# EAGLE design IICLCDKeyPad (EAGLE 6.1)

## Sheet 1 of 2
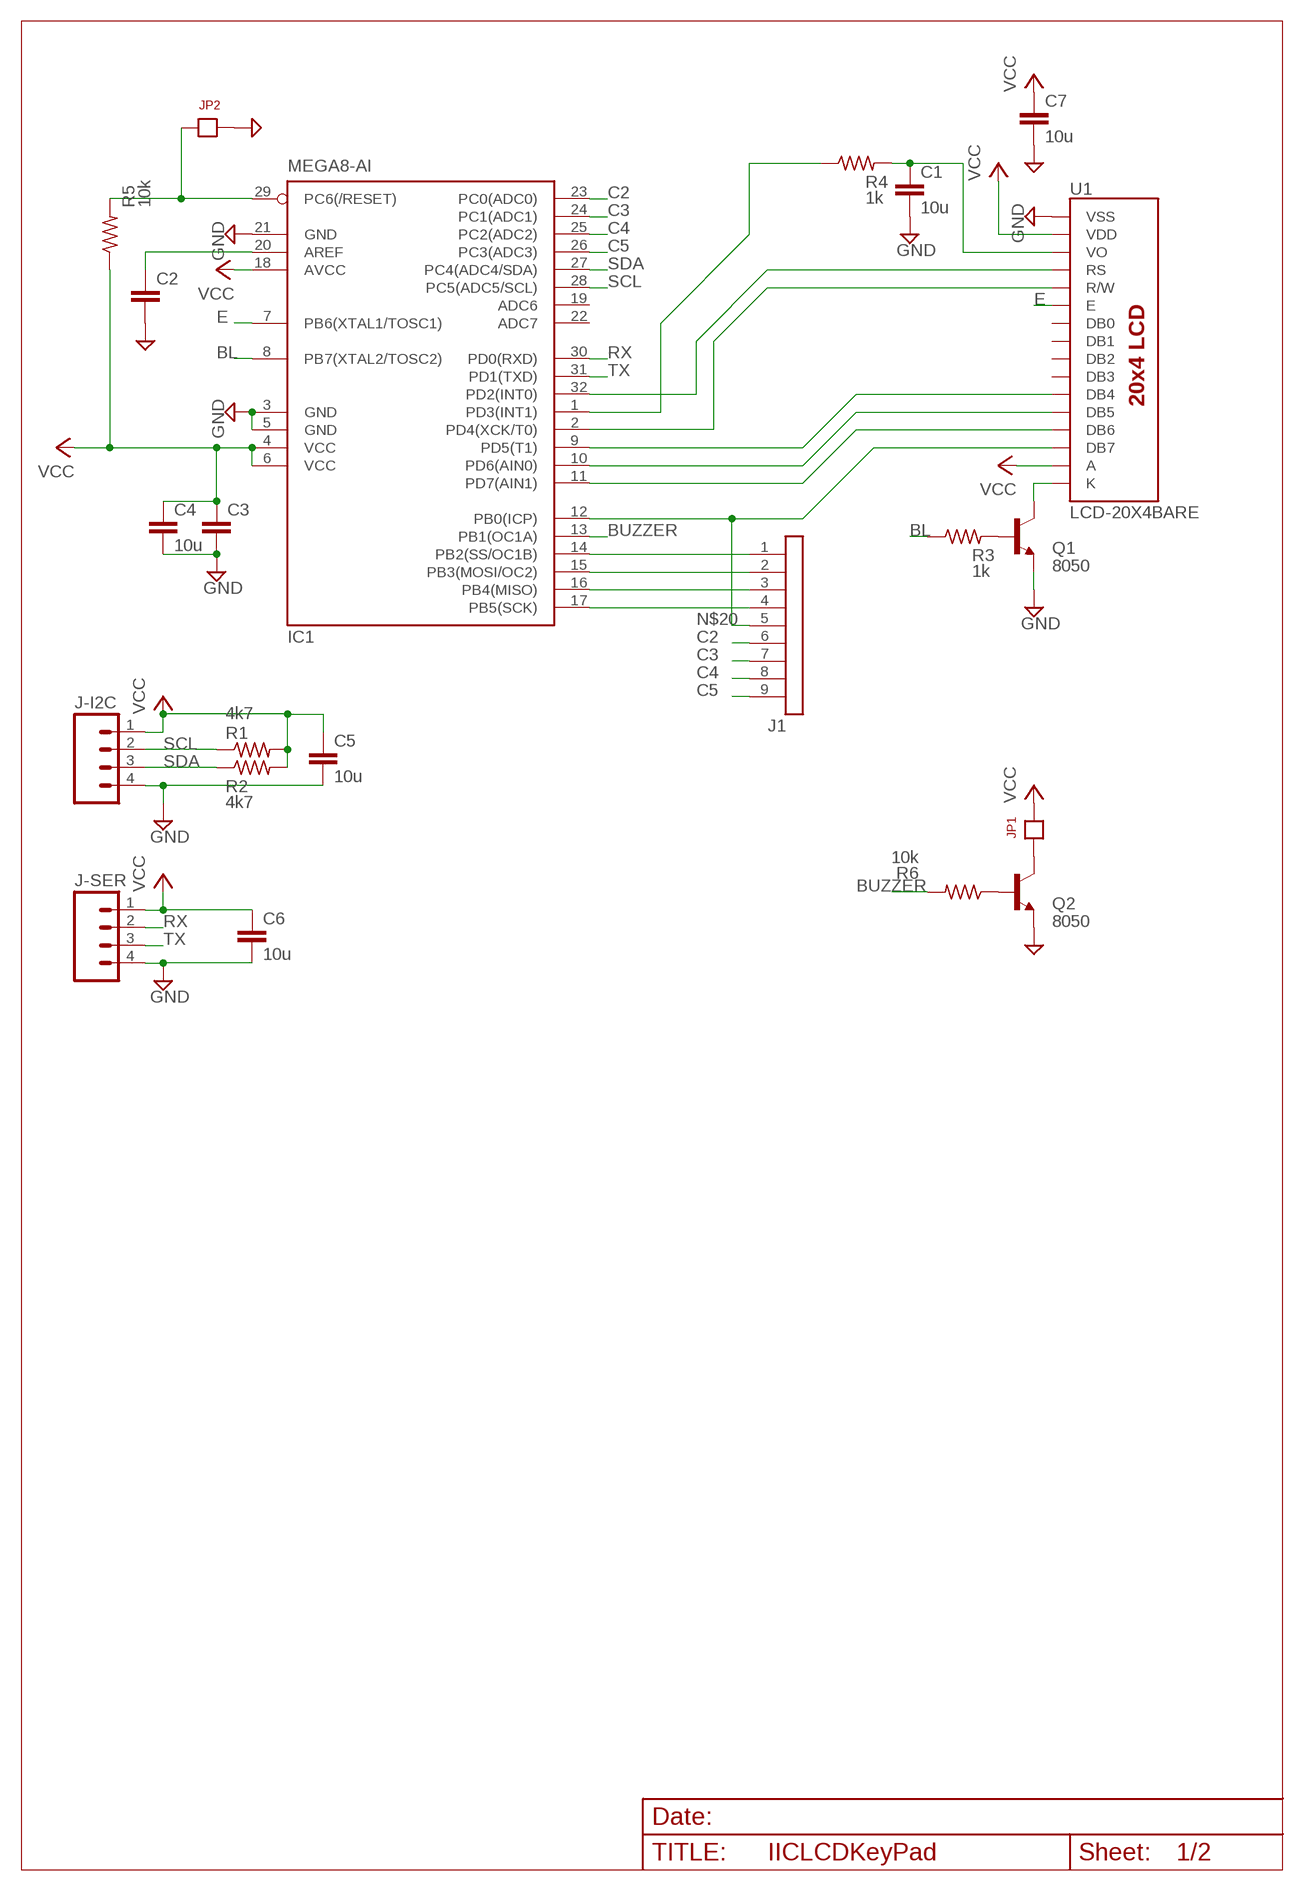
[diagram p0: schematic, sheet 1]

### Parts
C1  10u  CAP0805  [0805]
C2  CAP0603-CAP  [0603-CAP]
C3  CAP0603-CAP  [0603-CAP]
C4  10u  CAP0805  [0805]
C5  10u  CAP0805  [0805]
C6  10u  CAP0805  [0805]
C7  10u  CAP0805  [0805]
IC1  MEGA8-AI  [TQFP32-08]
J1  SIL-9  [SIL-9]
J-I2C  MO4POL  [MOLEX-4]
J-SER  MO4POL  [MOLEX-4]
JP1  JP1  [JP1]
JP2  JP1  [JP1]
Q1  8050  BC849SMD  [SOT23-BEC]
Q2  8050  BC849SMD  [SOT23-BEC]
R1  4k7  R-US_R0603  [R0603]
R2  4k7  R-US_R0603  [R0603]
R3  1k  R-US_R0603  [R0603]
R4  1k  R-US_R0603  [R0603]
R5  10k  R-US_R0603  [R0603]
R6  10k  R-US_R0603  [R0603]
U1  LCD-20X4BARE  [LCD-16X2_BARE]

### Nets
BL: IC1.8(PB7(XTAL2/TOSC2)) R3.1
BUZZER: IC1.13(PB1(OC1A)) R6.2
C2: IC1.23(PC0(ADC0)) J1.6
C3: IC1.24(PC1(ADC1)) J1.7
C4: IC1.25(PC2(ADC2)) J1.8
C5: IC1.26(PC3(ADC3)) J1.9
D6: IC1.11(PD7(AIN1)) U1.13(DB6)
E: IC1.7(PB6(XTAL1/TOSC1)) U1.6(E)
GND: C1.2 C2.2 C3.2 C4.2 C5.2 C6.2 C7.2 IC1.3(GND) IC1.5(GND) IC1.21(GND) J-I2C.4 J-SER.4 JP2.2 Q1.E Q2.E U1.1(VSS)
N$1: IC1.14(PB2(SS/OC1B)) J1.1
N$2: Q1.C U1.16(K)
N$3: Q1.B R3.2
N$4: C1.1 R4.2 U1.3(VO)
N$5: IC1.9(PD5(T1)) U1.11(DB4)
N$6: C2.1 IC1.20(AREF)
N$7: IC1.10(PD6(AIN0)) U1.12(DB5)
N$8: IC1.1(PD3(INT1)) R4.1
N$9: IC1.32(PD2(INT0)) U1.4(RS)
N$11: JP1.1 Q2.C
N$12: Q2.B R6.1
N$13: IC1.2(PD4(XCK/T0)) U1.5(R/W)
N$14: IC1.15(PB3(MOSI/OC2)) J1.2
N$16: IC1.29(PC6(/RESET)) JP2.1 R5.2
N$17: IC1.16(PB4(MISO)) J1.3
N$18: IC1.17(PB5(SCK)) J1.4
N$20: IC1.12(PB0(ICP)) J1.5 U1.14(DB7)
RX: IC1.30(PD0(RXD)) J-SER.2
SCL: IC1.28(PC5(ADC5/SCL)) J-I2C.2 R1.1
SDA: IC1.27(PC4(ADC4/SDA)) J-I2C.3 R2.1
TX: IC1.31(PD1(TXD)) J-SER.3
VCC: C3.1 C4.1 C5.1 C6.1 C7.1 IC1.4(VCC) IC1.6(VCC) IC1.18(AVCC) J-I2C.1 J-SER.1 JP1.2 R1.2 R2.2 R5.1 U1.2(VDD) U1.15(A)
Unconnected: IC1.19(ADC6) IC1.22(ADC7) U1.7(DB0) U1.8(DB1) U1.9(DB2) U1.10(DB3)

## Sheet 2 of 2

## Library data of the parts
C1-C7 = SparkFun-Passives:CAP: Capacitor Standard 0603 ceramic capacitor, and 0.1" leaded capacitor.
IC1 = atmel:MEGA8: MICROCONTROLLER 8 Kbytes FLASH, 1 kbytes SRAM, 512 bytes EEPROM, USART, 6-channel 10 bit ADC, 2-channel 8 bit ADC Pin compatible with Atmega48, ATMega88, ATMega168 Source: avr.lbr; MPN: ATMEGA8-16AU; OC_FARNELL: 9171371; OC_NEWARK: 73M8863
J1 = Andrew Connectors:SIL-9
J-I2C J-SER = Andrew Connectors:MO4POL
JP1 JP2 = Andrew Connectors:JP1
Q1 Q2 = transistor-npn:BC849*: NPN Transistor
R1-R6 = rcl:R-US_: RESISTOR, American symbol
U1 = Andrew Misc:LCD-20X4: Standard text-only 16x2 parallel input LCD

## Board
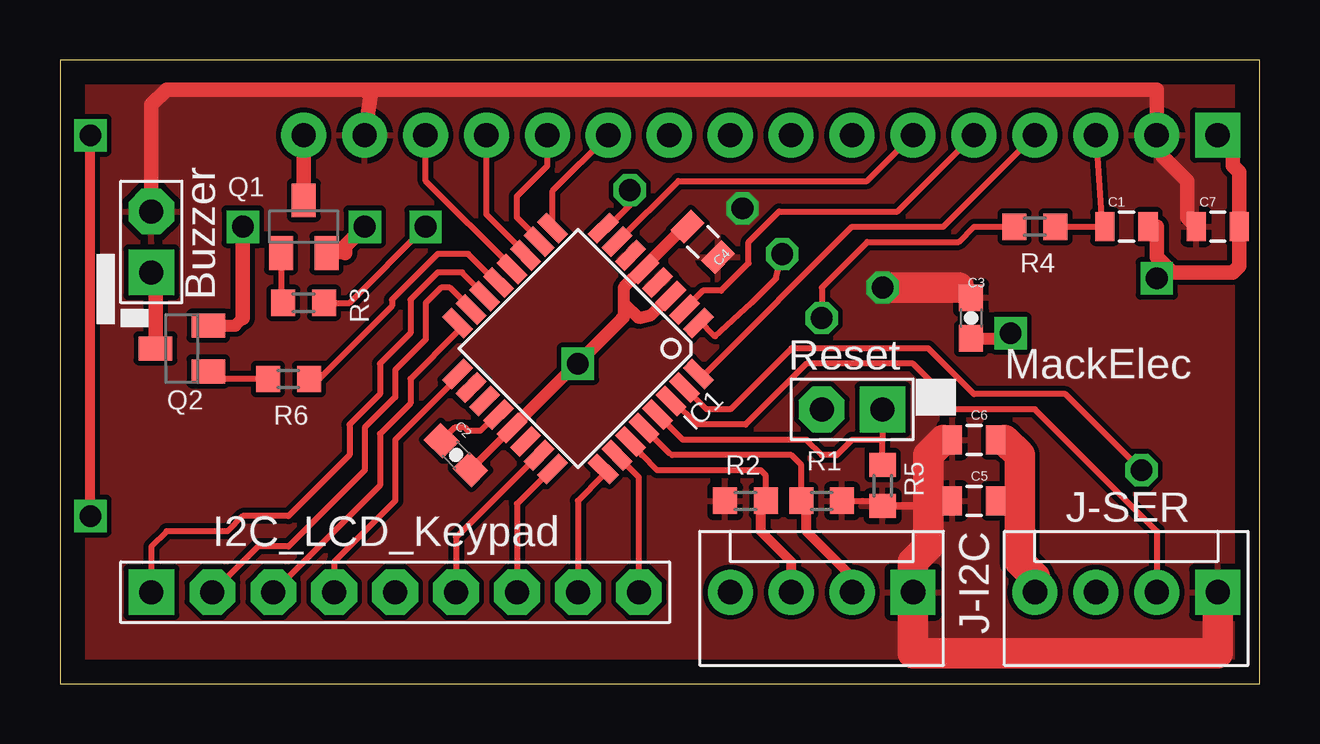
[diagram p1: board, top side]
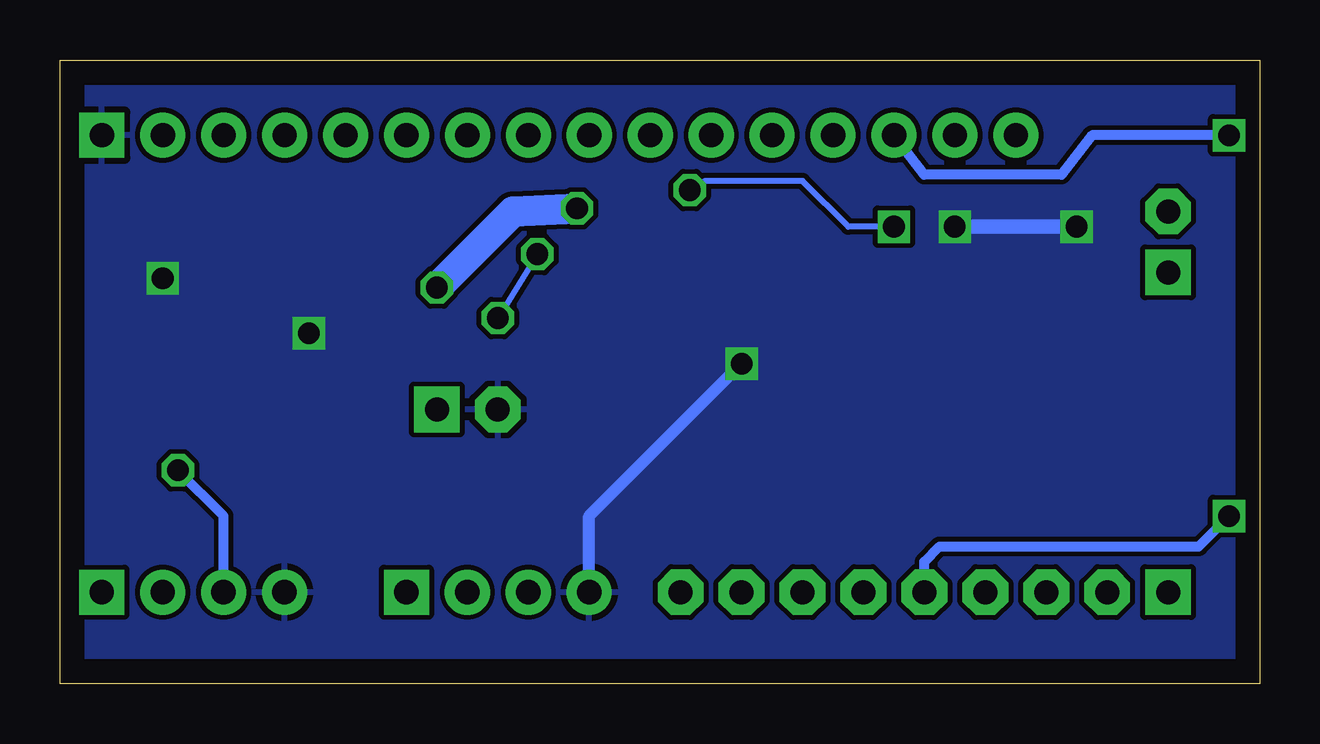
[diagram p2: board, bottom side, seen from below]

Size 50 x 26 mm. Coordinates in mm from the lower left corner, seen from the top.
Outline: 0,0 50,0 50,26 0,26 0,0
Copper layers (1*16): Top 0.035mm / dielectric 1.5mm / Bottom 0.035mm
Design rules: minimum track width 10mil, minimum drill 24mil, track to track 8mil, track to pad 8mil, pad to pad 8mil, via to via 8mil, smd to smd 8mil, copper to edge 40mil, drill to drill 8mil, minimum pad ring 10mil, minimum via ring 8mil, stop-mask expansion 4mil, vias tented up to drill 0mil, thermal gap 10mil

### Footprints (pad centres in the part's own frame; a part is rotated, then mirrored left to right if it is on the bottom)
0805 = smd 0.8 x 1.2: 1 -0.9,0; 2 0.9,0
0603-CAP = smd 1.1 x 1: 1 -0.85,0; 2 0.85,0
TQFP32-08 = smd 1.27 x 0.559: 1 -4.293,2.8; 2 -4.293,2; 3 -4.293,1.2; 4 -4.293,0.4; 5 -4.293,-0.4; 6 -4.293,-1.2; 7 -4.293,-2; 8 -4.293,-2.8; 17 4.293,-2.8; 18 4.293,-2; 19 4.293,-1.2; 20 4.293,-0.4; 21 4.293,0.4; 22 4.293,1.2; 23 4.293,2; 24 4.293,2.8 | smd 0.559 x 1.27: 9 -2.8,-4.293; 10 -2,-4.293; 11 -1.2,-4.293; 12 -0.4,-4.293; 13 0.4,-4.293; 14 1.2,-4.293; 15 2,-4.293; 16 2.8,-4.293; 25 2.8,4.293; 26 2,4.293; 27 1.2,4.293; 28 0.4,4.293; 29 -0.4,4.293; 30 -1.2,4.293; 31 -2,4.293; 32 -2.8,4.293
SIL-9 = drill 1 pad 1.905 square: 1 -11.43,0 | drill 1 pad 1.905 octagon: 2 -8.89,0; 3 -6.35,0; 4 -3.81,0; 5 -1.27,0; 6 1.27,0; 7 3.81,0; 8 6.35,0; 9 8.89,0
MOLEX-4 = drill 1.016 pad 1.88 square: 1 -3.81,0 | drill 1.016 pad 1.88: 2 -1.27,0; 3 1.27,0; 4 3.81,0
JP1 = drill 1 pad 1.905 square: 1 -1.27,0 | drill 1 pad 1.905 octagon: 2 1.27,0
SOT23-BEC = smd 1 x 1.4: B -0.95,-1.1; C 0,1.1; E 0.95,-1.1
R0603 = smd 1 x 1.1: 1 -0.85,0; 2 0.85,0
LCD-16X2_BARE = drill 1.016 pad 1.88 square: 1 0.004,0.006 | drill 1.016 pad 1.88: 2 2.544,0.006; 3 5.084,0.006; 4 7.624,0.006; 5 10.164,0.006; 6 12.704,0.006; 7 15.244,0.006; 8 17.784,0.006; 9 20.324,0.006; 10 22.864,0.006; 11 25.404,0.006; 12 27.944,0.006; 13 30.484,0.006; 14 33.024,0.006; 15 35.564,0.006; 16 38.104,0.006

### Placement (x,y rotation side)
C1  44.45,19.05 0 top
C2  16.51,9.53 315 top
C3  37.97,15.24 270 top
C4  26.8,18.41 135 top
C5  38.1,7.62 0 top
C6  38.1,10.16 0 top
C7  48.26,19.05 0 top
IC1  21.59,13.97 225 top
J1  15.24,3.81 0 top
J-I2C  31.75,3.81 180 top
J-SER  44.45,3.81 180 top
JP1  3.81,18.41 90 top
JP2  33.02,11.43 180 top
Q1  10.16,19.05 0 top
Q2  5.08,13.97 90 top
R1  31.75,7.62 0 top
R2  28.57,7.62 180 top
R3  10.16,15.88 180 top
R4  40.64,19.05 0 top
R5  34.29,8.26 90 top
R6  9.53,12.7 0 top
U1  48.26,22.86 0 bottom

### Tracks (layer width: path | path; a pad name or v marks a point on that pad's centre or on a via)
BL  (via drill 0.9)
  Top 0.254: R3.1 12.06,15.88 v15.24,19.05 | v23.75,20.57 24.13,20.32 22.8,18.98 IC1.8
  Bottom 0.254: v15.24,19.05 17.14,19.05 19.05,20.95 23.11,20.95 v23.75,20.57
BUZZER
  Top 0.254: IC1.13 18.2,16.72 17.02,17.91 15.75,17.91 13.84,16 13.84,15.75 10.79,12.7 R6.2
C2
  Top 0.254: IC1.23 19.71,9.3 16.51,6.1 J1.6
C3
  Top 0.254: IC1.24 20.54,8.98 19.05,7.49 J1.7
C4
  Top 0.254: IC1.25 22.64,8.68 21.59,7.62 J1.8
C5
  Top 0.254: J1.9 24.13,8.6 IC1.26
D6
  Top 0.254: IC1.11 19.4,17.93 17.78,19.56 U1.13
E
  Top 0.254: U1.6 33.65,20.95 25.78,20.95 23.25,18.42 IC1.7
GND  (via drill 0.9)
  Top 0.254: C4.2 26.16,19.18
  Top 0.305: 39.37,10.16 C6.2 | C5.2 40.01,7.62 | C2.2 IC1.21
  Top 0.508: 23.5,15.88 23.5,16.51 24.27,17.29 IC1.5 24.34,17.36 26.16,19.18 | 23.5,15.88 24.13,15.24 24.64,15.37 25.35,16.08 IC1.3 | 23.5,15.88 23.5,15.24 | 23.5,15.24 23.43,15.24 IC1.21 | v21.59,13.34 23.5,15.24 | Q2.E 7.3,14.92 7.62,15.24 | Q1.E 11.89,17.95 | C3.2 39.41,14.39 v39.62,14.61
  Top 0.61: 11.89,17.95 11.89,18.25 v12.7,19.05 | v7.62,19.05 7.62,15.24 | U1.1 48.9,22.73 48.9,21.59 49.16,21.32 C7.2 49.16,17.41 48.9,17.14 46.35,17.14 45.72,17.78 45.72,19.05 C1.2
  Top 1.27: J-SER.4 40.64,4.45 40.01,5.08 40.01,7.62 40.01,9.53 39.37,10.16
  Bottom 0.508: J-I2C.4 27.94,6.99 v21.59,13.34
  Bottom 0.61: v12.7,19.05 v7.62,19.05
  other vias: 45.72,16.89
  pour Bottom: 0.64,25.4 49.53,25.4 49.53,0.64 0.64,0.64
N$1
  Top 0.254: IC1.14 17.75,16.16 16.76,17.14 15.75,17.14 14.61,16 14.61,14.61 13.34,13.34 13.34,12.06 12.06,10.79 12.06,9.53 9.53,6.99 7.62,6.99 6.99,6.35 4.45,6.35 3.81,5.71 J1.1
N$2
  Top 0.61: Q1.C U1.16
N$3
  Top 0.254: Q1.B 9.21,16.19 9.53,15.88 R3.2
N$4
  Top 0.254: R4.2 C1.1 43.43,19.17 U1.3
N$5
  Top 0.254: IC1.9 20.54,20.55 U1.11
N$6
  Top 0.254: IC1.20 18.2,11.22 17.53,10.54 17.02,10.54 16.89,10.67 16.45,10.67 C2.1
N$7
  Top 0.254: IC1.10 19.97,18.51 19.05,19.43 19.05,20.32 20.32,21.59 U1.12
N$8  (via drill 0.9)
  Top 0.254: IC1.1 26.61,15.18 27.3,14.48 28.83,15.88 29.84,16.89 v30.1,17.91 | R4.1 38.1,19.05 37.47,18.41 33.66,18.41 31.75,16.51 v31.75,15.24
  Bottom 0.254: v30.1,17.91 v31.75,15.24
N$9
  Top 0.254: IC1.32 26.89,12.91 33.02,19.05 36.82,19.05 U1.4
N$11
  Top 0.61: Q2.C 3.98,16.98 JP1.1
N$12
  Top 0.254: R6.1 6.5,12.7 Q2.B
N$13
  Top 0.254: IC1.2 26.29,15.88 26.8,16.38 27.56,16.38 28.7,17.53 28.7,18.41 29.97,19.68 34.91,19.68 U1.5
N$14
  Top 0.254: IC1.15 16.89,15.88 16.26,16.51 15.88,16.51 15.24,15.88 15.24,14.35 13.97,13.08 13.97,11.94 12.7,10.67 12.7,8.89 9.53,5.71 8.26,5.71 J1.2
N$16
  Top 0.254: R5.2 34.29,10.16 | JP2.1 34.29,10.16 | 34.29,10.16 33.02,10.16 32.38,9.53 31.75,9.53 31.11,10.16 25.97,10.16 IC1.29
N$17
  Top 0.254: IC1.16 16.57,14.67 14.61,12.7 14.61,11.68 13.34,10.41 13.34,8.26 J1.3
N$18
  Top 0.254: IC1.17 16.57,12.77 13.97,10.16 13.97,7.62 11.43,5.08 J1.4
N$20  (via drill 0.9)
  Top 0.254: IC1.12 18.84,17.36 15.24,20.95 U1.14
  Top 0.406: v1.27,6.99 v1.27,22.86
  Bottom 0.406: J1.5 13.97,5.08 13.34,5.71 2.54,5.71 v1.27,6.99 | v1.27,22.86 6.99,22.86 8.26,21.21 13.97,21.21 U1.14
RX
  Top 0.254: IC1.30 25.55,11.78 26.54,10.79 28.57,10.79 31.11,13.34 35.56,13.34 36.83,12.06 36.83,11.43 40.64,11.43 45.72,6.35 J-SER.2
SCL
  Top 0.254: R1.1 30.9,9.11 30.48,9.53 25.53,9.53 25.4,9.59 IC1.28
  Top 0.406: J-I2C.2 33.02,4.45 31.11,6.35 31.11,7.41 R1.1
SDA
  Top 0.254: R2.1 29.43,8.68 29.21,8.89 24.89,8.89 24.26,9.53 24.13,9.73 IC1.27
  Top 0.406: J-I2C.3 30.48,5.08 29.21,6.35 29.21,7.41 R2.1
TX  (via drill 0.9)
  Top 0.254: IC1.31 26.96,11.43 27.94,11.43 30.48,13.97 36.2,13.97 38.1,12.06 41.91,12.06 v45.09,8.89
  Bottom 0.406: J-SER.3 43.18,6.99 v45.09,8.89
VCC  (via drill 0.9)
  Top 0.254: R1.2 34.08,7.62 R5.1
  Top 0.305: C5.1 36.2,7.62 35.98,7.41 R5.1 | C6.1 36.83,10.16
  Top 0.406: IC1.6 23.9,17.93
  Top 0.61: JP1.2 3.81,24.13 4.45,24.77 12.7,24.77 | 12.7,24.77 45.72,24.77 45.72,23.37 U1.2 45.97,21.98 46.99,20.95 46.99,19.42 C7.1 | U1.15 12.95,24.52 12.7,24.77
  Top 1.27: 36.83,10.16 36.2,9.53 36.2,7.62 36.2,5.71 35.56,5.08 J-I2C.1 35.56,1.27 48.26,1.27 J-SER.1 | v34.29,16.51 37.47,16.51
  Bottom 1.27: v28.45,19.81 31.11,19.68 v34.29,16.51
  pour Top: 0.64,25.4 49.53,25.4 49.53,0.64 0.64,0.64

### Text on the board
tPlace: Buzzer | Reset | MackElec | I2C_LCD_Keypad